# EAGLE design main (EAGLE 6.1)
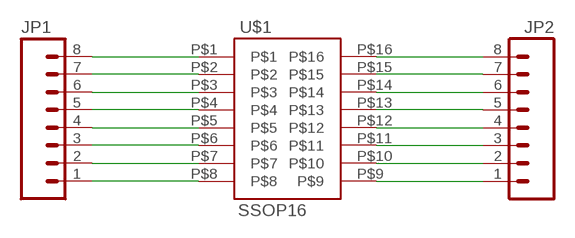
[diagram p0: schematic, sheet 1]

## Parts
JP1  M08LONGPADS  [1X08_LONGPADS]
JP2  M08LONGPADS  [1X08_LONGPADS]
U$1  SSOP16  [SSOP16]

## Nets
N$1: JP1.8 U$1.P$1
N$2: JP1.7 U$1.P$2
N$3: JP1.6 U$1.P$3
N$4: JP1.5 U$1.P$4
N$5: JP1.4 U$1.P$5
N$6: JP1.3 U$1.P$6
N$7: JP1.2 U$1.P$7
N$8: JP1.1 U$1.P$8
N$9: JP2.8 U$1.P$16
N$10: JP2.7 U$1.P$15
N$11: JP2.6 U$1.P$14
N$12: JP2.5 U$1.P$13
N$13: JP2.4 U$1.P$12
N$14: JP2.3 U$1.P$11
N$15: JP2.2 U$1.P$10
N$16: JP2.1 U$1.P$9

## Library data of the parts
JP1 JP2 = SparkFun:M08: Header 8 Standard 8-pin 0.1" header. Use with straight break away headers (SKU : PRT-00116), right angle break away headers (PRT-00553), swiss pins (PRT-00743), machine pins (PRT-00117), and female headers (PRT-00115).
U$1 = SparkFun:SSOP16

## Board
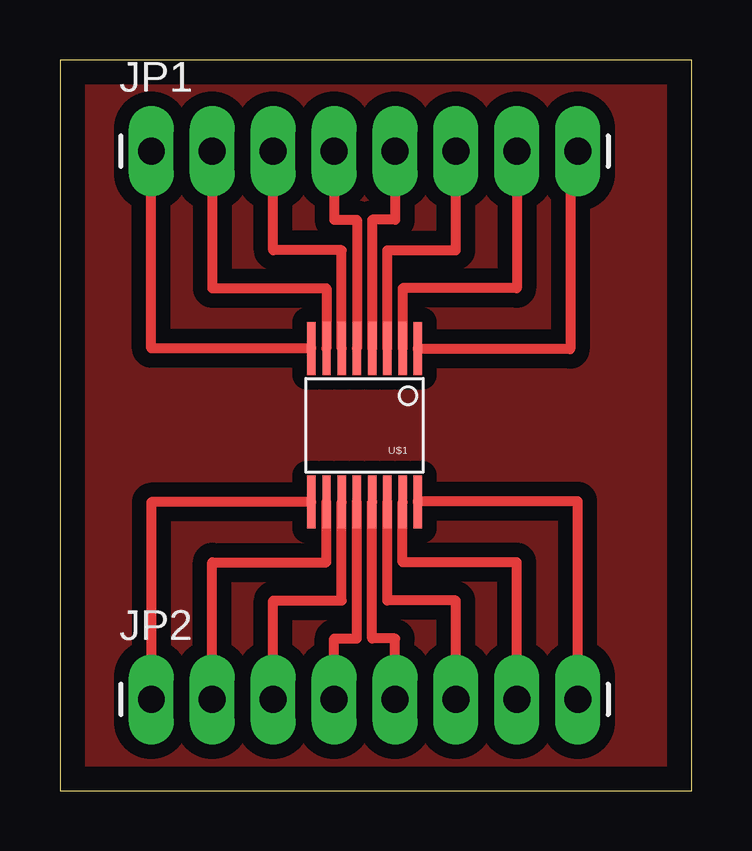
[diagram p1: board, top side]

Size 26.34 x 30.47 mm. Coordinates in mm from the lower left corner, seen from the top.
Outline: 0,0 26.34,0 26.34,30.47 0,30.47 0,0
Copper layers (1*16): Top 0.035mm / dielectric 1.5mm / Bottom 0.035mm
Design rules: minimum track width 10mil, minimum drill 24mil, track to track 8mil, track to pad 8mil, pad to pad 8mil, via to via 8mil, smd to smd 8mil, copper to edge 40mil, drill to drill 8mil, minimum pad ring 10mil, minimum via ring 8mil, stop-mask expansion 4mil, vias tented up to drill 0mil, thermal gap 10mil

### Footprints (pad centres in the part's own frame; a part is rotated, then mirrored left to right if it is on the bottom)
1X08_LONGPADS = drill 1.118 pad 1.88 long: 1 0,0; 2 2.54,0; 3 5.08,0; 4 7.62,0; 5 10.16,0; 6 12.7,0; 7 15.24,0; 8 17.78,0
SSOP16 = smd 0.35 x 2.2: P$1 -2.223,-3.2; P$2 -1.587,-3.2; P$3 -0.953,-3.2; P$4 -0.318,-3.2; P$5 0.318,-3.2; P$6 0.953,-3.2; P$7 1.587,-3.2; P$8 2.223,-3.2; P$9 2.223,3.2; P$10 1.587,3.2; P$11 0.953,3.2; P$12 0.318,3.2; P$13 -0.318,3.2; P$14 -0.953,3.2; P$15 -1.587,3.2; P$16 -2.223,3.2

### Placement (x,y rotation side)
JP1  3.81,26.67 0 top
JP2  3.81,3.81 0 top
U$1  12.7,15.24 180 top

### Tracks (layer width: path | path; a pad name or v marks a point on that pad's centre or on a via)
N$1
  Top 0.406: JP1.8 21.27,26.67 21.27,18.41 14.92,18.41 U$1.P$1
N$2
  Top 0.406: JP1.7 19.05,20.95 14.29,20.95 U$1.P$2
N$3
  Top 0.406: U$1.P$3 13.65,22.54 16.51,22.54 JP1.6
N$4
  Top 0.406: JP1.5 13.97,23.81 13.02,23.81 U$1.P$4
N$5
  Top 0.406: JP1.4 11.43,23.81 12.38,23.81 U$1.P$5
N$6
  Top 0.406: U$1.P$6 11.75,22.54 8.89,22.54 JP1.3
N$7
  Top 0.406: JP1.2 6.35,20.95 11.11,20.95 U$1.P$7
N$8
  Top 0.406: U$1.P$8 3.81,18.44 JP1.1
N$9
  Top 0.406: JP2.8 21.59,12.06 14.92,12.06 U$1.P$16
N$10
  Top 0.406: JP2.7 19.05,9.53 14.29,9.53 U$1.P$15
N$11
  Top 0.406: JP2.6 16.51,7.94 13.65,7.94 U$1.P$14
N$12
  Top 0.406: JP2.5 13.97,6.35 13.02,6.35 U$1.P$13
N$13
  Top 0.406: JP2.4 11.43,6.35 12.38,6.35 U$1.P$12
N$14
  Top 0.406: JP2.3 8.89,7.94 11.75,7.94 U$1.P$11
N$15
  Top 0.406: JP2.2 6.35,9.53 11.11,9.53 U$1.P$10
N$16
  Top 0.406: U$1.P$9 3.81,12.04 JP2.1
N$17
  pour Top (isolate 0.61): 0,30.48 26.35,30.48 26.35,29.84 26.35,0 0,0